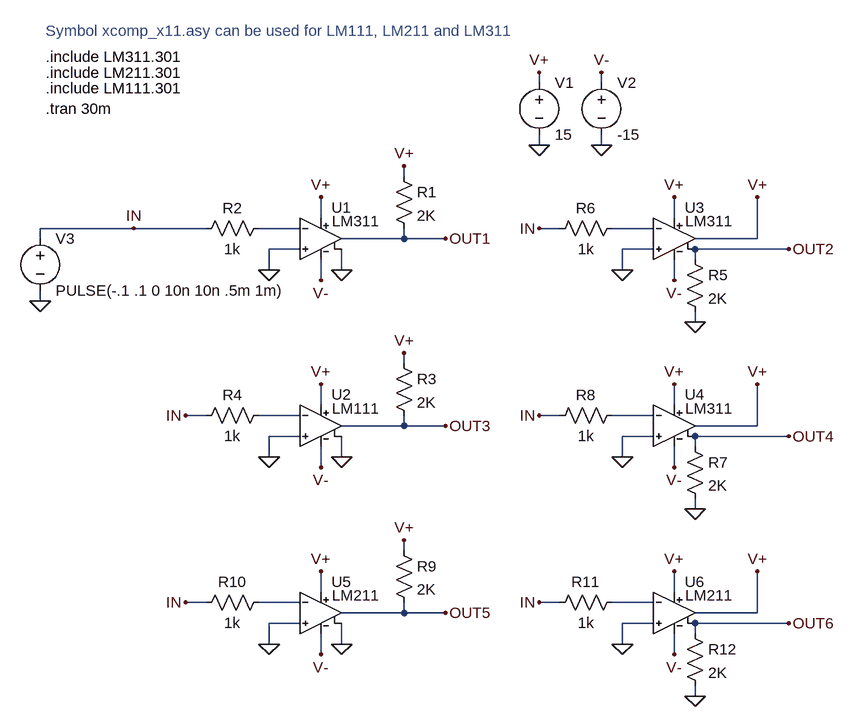
[diagram p0: schematic LM311_211_111.asc]
LM311_211_111.asc, the LTspice schematic file:
Version 4
SHEET 1 880 964
WIRE 240 0 240 -16
WIRE 336 0 336 -16
WIRE 240 96 240 80
WIRE 336 96 336 80
WIRE 32 144 32 128
WIRE -96 208 -96 176
WIRE 448 208 448 176
WIRE -384 224 -528 224
WIRE -272 224 -384 224
WIRE -128 224 -192 224
WIRE 272 224 240 224
WIRE 416 224 352 224
WIRE -528 240 -528 224
WIRE 32 240 32 224
WIRE 32 240 -64 240
WIRE 96 240 32 240
WIRE 576 240 576 176
WIRE 576 240 480 240
WIRE -128 256 -176 256
WIRE 416 256 368 256
WIRE 624 256 480 256
WIRE 480 272 480 256
WIRE -176 288 -176 256
WIRE -64 288 -64 256
WIRE 368 288 368 256
WIRE -96 304 -96 272
WIRE 448 304 448 272
WIRE -528 336 -528 320
WIRE 480 368 480 352
WIRE 32 432 32 416
WIRE -96 496 -96 464
WIRE 448 496 448 464
WIRE -272 512 -304 512
WIRE -128 512 -192 512
WIRE 272 512 240 512
WIRE 416 512 352 512
WIRE 32 528 32 512
WIRE 32 528 -64 528
WIRE 96 528 32 528
WIRE 576 528 576 464
WIRE 576 528 480 528
WIRE -128 544 -176 544
WIRE 416 544 368 544
WIRE 624 544 480 544
WIRE 480 560 480 544
WIRE -176 576 -176 544
WIRE -64 576 -64 544
WIRE 368 576 368 544
WIRE -96 592 -96 560
WIRE 448 592 448 560
WIRE 480 656 480 640
WIRE 32 720 32 704
WIRE -96 784 -96 752
WIRE 448 784 448 752
WIRE -272 800 -304 800
WIRE -128 800 -192 800
WIRE 272 800 240 800
WIRE 416 800 352 800
WIRE 32 816 32 800
WIRE 32 816 -64 816
WIRE 96 816 32 816
WIRE 576 816 576 752
WIRE 576 816 480 816
WIRE -128 832 -176 832
WIRE 416 832 368 832
WIRE 624 832 480 832
WIRE 480 848 480 832
WIRE -176 864 -176 832
WIRE -64 864 -64 832
WIRE 368 864 368 832
WIRE -96 880 -96 848
WIRE 448 880 448 848
WIRE 480 944 480 928
FLAG 336 96 0
FLAG 240 96 0
FLAG 240 -16 V+
FLAG 336 -16 V-
FLAG -96 176 V+
FLAG -528 336 0
FLAG -176 288 0
FLAG -64 288 0
FLAG -96 304 V-
FLAG 96 240 OUT1
FLAG -96 464 V+
FLAG -176 576 0
FLAG -64 576 0
FLAG -96 592 V-
FLAG 96 528 OUT3
FLAG 448 176 V+
FLAG 368 288 0
FLAG 480 368 0
FLAG 448 304 V-
FLAG 624 256 OUT2
FLAG 448 464 V+
FLAG 368 576 0
FLAG 448 592 V-
FLAG 32 128 V+
FLAG 576 176 V+
FLAG 32 416 V+
FLAG -384 224 IN
FLAG 240 224 IN
FLAG 240 512 IN
FLAG 480 656 0
FLAG 624 544 OUT4
FLAG 576 464 V+
FLAG -304 512 IN
FLAG -96 752 V+
FLAG -176 864 0
FLAG -64 864 0
FLAG -96 880 V-
FLAG 96 816 OUT5
FLAG 448 752 V+
FLAG 368 864 0
FLAG 448 880 V-
FLAG 32 704 V+
FLAG 240 800 IN
FLAG 480 944 0
FLAG 624 832 OUT6
FLAG 576 752 V+
FLAG -304 800 IN
SYMBOL voltage 240 -16 R0
SYMATTR InstName V1
SYMATTR Value 15
SYMBOL voltage 336 -16 R0
SYMATTR InstName V2
SYMATTR Value -15
SYMBOL voltage -528 224 R0
WINDOW 123 0 0 Left 0
WINDOW 39 0 0 Left 0
SYMATTR InstName V3
SYMATTR Value PULSE(-.1 .1 0 10n 10n .5m 1m)
SYMBOL res 16 128 R0
SYMATTR InstName R1
SYMATTR Value 2K
SYMBOL xcomp_x11 -96 176 R0
SYMATTR InstName U1
SYMATTR Value LM311
SYMBOL res -288 240 R270
WINDOW 0 32 56 VTop 0
WINDOW 3 0 56 VBottom 0
SYMATTR InstName R2
SYMATTR Value 1k
SYMBOL res 16 416 R0
SYMATTR InstName R3
SYMATTR Value 2K
SYMBOL xcomp_x11 -96 464 R0
SYMATTR InstName U2
SYMATTR Value LM111
SYMBOL res -288 528 R270
WINDOW 0 32 56 VTop 0
WINDOW 3 0 56 VBottom 0
SYMATTR InstName R4
SYMATTR Value 1k
SYMBOL res 464 256 R0
SYMATTR InstName R5
SYMATTR Value 2K
SYMBOL xcomp_x11 448 176 R0
SYMATTR InstName U3
SYMATTR Value LM311
SYMBOL res 256 240 R270
WINDOW 0 32 56 VTop 0
WINDOW 3 0 56 VBottom 0
SYMATTR InstName R6
SYMATTR Value 1k
SYMBOL xcomp_x11 448 464 R0
SYMATTR InstName U4
SYMATTR Value LM311
SYMBOL res 256 528 R270
WINDOW 0 32 56 VTop 0
WINDOW 3 0 56 VBottom 0
SYMATTR InstName R8
SYMATTR Value 1k
SYMBOL res 464 544 R0
SYMATTR InstName R7
SYMATTR Value 2K
SYMBOL res 16 704 R0
SYMATTR InstName R9
SYMATTR Value 2K
SYMBOL xcomp_x11 -96 752 R0
SYMATTR InstName U5
SYMATTR Value LM211
SYMBOL res -288 816 R270
WINDOW 0 32 56 VTop 0
WINDOW 3 0 56 VBottom 0
SYMATTR InstName R10
SYMATTR Value 1k
SYMBOL xcomp_x11 448 752 R0
SYMATTR InstName U6
SYMATTR Value LM211
SYMBOL res 256 816 R270
WINDOW 0 32 56 VTop 0
WINDOW 3 0 56 VBottom 0
SYMATTR InstName R11
SYMATTR Value 1k
SYMBOL res 464 832 R0
SYMATTR InstName R12
SYMATTR Value 2K
TEXT -520 40 Left 0 !.tran 30m
TEXT -520 -40 Left 0 !.include LM311.301
TEXT -520 -16 Left 0 !.include LM211.301
TEXT -520 -80 Left 0 ;Symbol xcomp_x11.asy can be used for LM111, LM211 and LM311
TEXT -520 8 Left 0 !.include LM111.301

The netlist it stands for:
* LM311_211_111.asc
V1 V+ 0 15
V2 V- 0 -15
V3 IN 0 PULSE(-.1 .1 0 10n 10n .5m 1m)
R1 V+ OUT1 2K
XU1 0 N001 V+ V- OUT1 0 LM311  ; pins In+ In- V+ V- OUT G
R2 IN N001 1k
R3 V+ OUT3 2K
XU2 0 N003 V+ V- OUT3 0 LM111  ; pins In+ In- V+ V- OUT G
R4 IN N003 1k
R5 OUT2 0 2K
XU3 0 N002 V+ V- V+ OUT2 LM311  ; pins In+ In- V+ V- OUT G
R6 IN N002 1k
XU4 0 N004 V+ V- V+ OUT4 LM311  ; pins In+ In- V+ V- OUT G
R8 IN N004 1k
R7 OUT4 0 2K
R9 V+ OUT5 2K
XU5 0 N005 V+ V- OUT5 0 LM211  ; pins In+ In- V+ V- OUT G
R10 IN N005 1k
XU6 0 N006 V+ V- V+ OUT6 LM211  ; pins In+ In- V+ V- OUT G
R11 IN N006 1k
R12 OUT6 0 2K
.tran 30m
.include LM311.301
.include LM211.301
* Symbol xcomp_x11.asy can be used for LM111, LM211 and LM311
.include LM111.301
.backanno
.end